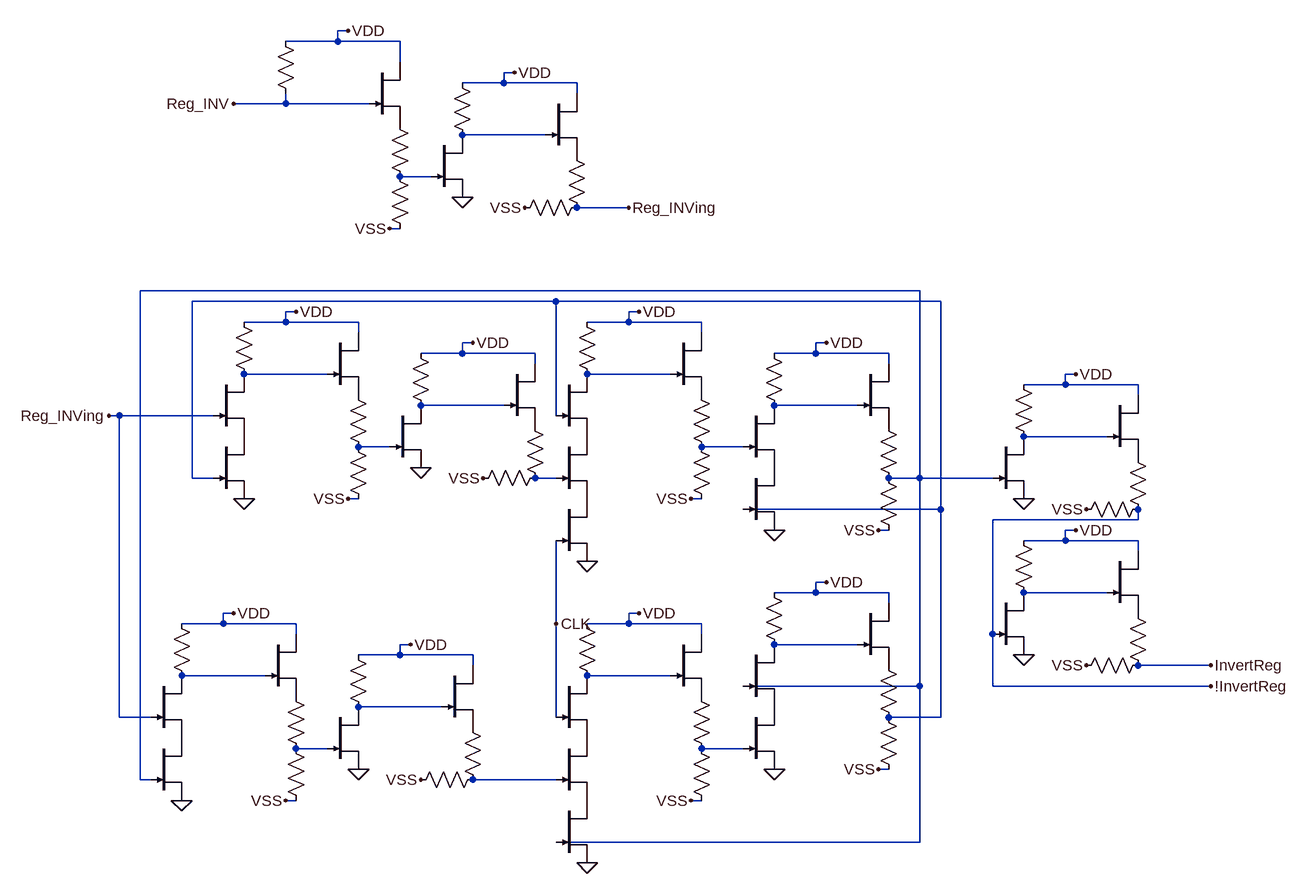
[diagram p0: schematic inverter_logic.asc]
inverter_logic.asc, the LTspice schematic file:
Version 4.1
SHEET 1 109444 42780
WIRE -992 -1136 -1008 -1136
WIRE -1008 -1120 -1008 -1136
WIRE -1008 -1120 -1088 -1120
WIRE -912 -1120 -1008 -1120
WIRE -912 -1088 -912 -1120
WIRE -736 -1072 -752 -1072
WIRE -752 -1056 -752 -1072
WIRE -752 -1056 -816 -1056
WIRE -640 -1056 -752 -1056
WIRE -640 -1040 -640 -1056
WIRE -1088 -1024 -1088 -1040
WIRE -1088 -1024 -1168 -1024
WIRE -960 -1024 -1088 -1024
WIRE -688 -976 -816 -976
WIRE -864 -912 -912 -912
WIRE -560 -864 -640 -864
WIRE -912 -832 -928 -832
WIRE -112 -736 -1312 -736
WIRE -672 -720 -1232 -720
WIRE -80 -720 -672 -720
WIRE -1072 -704 -1088 -704
WIRE -544 -704 -560 -704
WIRE -1088 -688 -1088 -704
WIRE -1088 -688 -1152 -688
WIRE -976 -688 -1088 -688
WIRE -560 -688 -560 -704
WIRE -560 -688 -624 -688
WIRE -448 -688 -560 -688
WIRE -976 -672 -976 -688
WIRE -448 -672 -448 -688
WIRE -800 -656 -816 -656
WIRE -256 -656 -272 -656
WIRE -816 -640 -816 -656
WIRE -816 -640 -880 -640
WIRE -704 -640 -816 -640
WIRE -272 -640 -272 -656
WIRE -272 -640 -336 -640
WIRE -160 -640 -272 -640
WIRE -704 -624 -704 -640
WIRE -160 -624 -160 -640
WIRE -1024 -608 -1152 -608
WIRE -496 -608 -624 -608
WIRE 128 -608 112 -608
WIRE 112 -592 112 -608
WIRE 112 -592 48 -592
WIRE 224 -592 112 -592
WIRE 224 -576 224 -592
WIRE -752 -560 -880 -560
WIRE -208 -560 -336 -560
WIRE -1344 -544 -1360 -544
WIRE -1200 -544 -1344 -544
WIRE -672 -544 -672 -720
WIRE 176 -512 48 -512
WIRE -928 -496 -976 -496
WIRE -384 -496 -448 -496
WIRE -1232 -448 -1232 -720
WIRE -1200 -448 -1232 -448
WIRE -672 -448 -704 -448
WIRE -112 -448 -112 -736
WIRE -112 -448 -160 -448
WIRE 0 -448 -112 -448
WIRE -976 -416 -992 -416
WIRE -448 -416 -464 -416
WIRE -80 -400 -80 -720
WIRE -80 -400 -384 -400
WIRE 224 -384 224 -400
WIRE 224 -384 0 -384
WIRE -160 -368 -176 -368
WIRE 128 -368 112 -368
WIRE 112 -352 112 -368
WIRE 112 -352 48 -352
WIRE 224 -352 112 -352
WIRE 224 -336 224 -352
WIRE -256 -288 -272 -288
WIRE -272 -272 -272 -288
WIRE -272 -272 -336 -272
WIRE -160 -272 -272 -272
WIRE 176 -272 48 -272
WIRE -160 -256 -160 -272
WIRE -1168 -240 -1184 -240
WIRE -544 -240 -560 -240
WIRE -1184 -224 -1184 -240
WIRE -1184 -224 -1248 -224
WIRE -1072 -224 -1184 -224
WIRE -672 -224 -672 -352
WIRE -560 -224 -560 -240
WIRE -560 -224 -624 -224
WIRE -448 -224 -560 -224
WIRE -1072 -208 -1072 -224
WIRE -448 -208 -448 -224
WIRE 0 -208 0 -384
WIRE -896 -192 -912 -192
WIRE -208 -192 -336 -192
WIRE -912 -176 -912 -192
WIRE -912 -176 -976 -176
WIRE -800 -176 -912 -176
WIRE -800 -160 -800 -176
WIRE 336 -160 224 -160
WIRE -1120 -144 -1248 -144
WIRE -496 -144 -624 -144
WIRE -112 -128 -112 -448
WIRE -112 -128 -384 -128
WIRE 0 -128 0 -208
WIRE 336 -128 0 -128
WIRE -848 -96 -976 -96
WIRE -1344 -80 -1344 -544
WIRE -1296 -80 -1344 -80
WIRE -672 -80 -672 -224
WIRE -80 -80 -80 -400
WIRE -80 -80 -160 -80
WIRE -1024 -32 -1072 -32
WIRE -384 -32 -448 -32
WIRE -160 0 -176 0
WIRE -1312 16 -1312 -736
WIRE -1296 16 -1312 16
WIRE -672 16 -800 16
WIRE -1072 48 -1088 48
WIRE -448 48 -464 48
WIRE -112 112 -112 -128
WIRE -112 112 -672 112
FLAG -1168 -1024 Reg_INV
FLAG -816 -880 0
FLAG -992 -1136 VDD
FLAG -736 -1072 VDD
FLAG -928 -832 VSS
FLAG -720 -864 VSS
FLAG -1152 -416 0
FLAG -880 -464 0
FLAG -1072 -704 VDD
FLAG -800 -656 VDD
FLAG -992 -416 VSS
FLAG -784 -448 VSS
FLAG -1248 48 0
FLAG -976 0 0
FLAG -1168 -240 VDD
FLAG -896 -192 VDD
FLAG -1088 48 VSS
FLAG -880 16 VSS
FLAG -624 -320 0
FLAG -544 -704 VDD
FLAG -464 -416 VSS
FLAG -624 144 0
FLAG -544 -240 VDD
FLAG -464 48 VSS
FLAG -336 -368 0
FLAG -256 -656 VDD
FLAG -176 -368 VSS
FLAG -336 0 0
FLAG -256 -288 VDD
FLAG -176 0 VSS
FLAG -672 -224 CLK
FLAG -560 -864 Reg_INVing
FLAG -1360 -544 Reg_INVing
FLAG 48 -416 0
FLAG 128 -608 VDD
FLAG 144 -400 VSS
FLAG 48 -176 0
FLAG 128 -368 VDD
FLAG 144 -160 VSS
FLAG 336 -160 InvertReg
FLAG 336 -128 !InvertReg
SYMBOL res -1104 -1136 R0
WINDOW 0 -35 57 Invisible 2
WINDOW 3 34 56 Invisible 2
SYMATTR InstName R3757
SYMATTR Value 100k
SYMBOL njf -960 -1088 R0
WINDOW 0 56 32 Invisible 2
WINDOW 3 56 72 Invisible 2
SYMATTR InstName J_F944
SYMATTR Value DR
SYMBOL res -928 -1008 R0
WINDOW 0 -24 60 Invisible 2
WINDOW 3 34 58 Invisible 2
SYMATTR InstName R3758
SYMATTR Value 1k
SYMBOL res -928 -928 R0
WINDOW 0 -22 62 Invisible 2
WINDOW 3 37 62 Invisible 2
SYMATTR InstName R3759
SYMATTR Value 4.8k
SYMBOL njf -864 -976 R0
WINDOW 0 56 32 Invisible 2
WINDOW 3 56 72 Invisible 2
SYMATTR InstName J_A2331
SYMATTR Value DR
SYMBOL res -832 -1072 R0
WINDOW 0 56 32 Invisible 2
WINDOW 3 56 72 Invisible 2
SYMATTR InstName R3760
SYMATTR Value 50k
SYMBOL njf -688 -1040 R0
WINDOW 0 56 32 Invisible 2
WINDOW 3 56 72 Invisible 2
SYMATTR InstName J_A2332
SYMATTR Value DR
SYMBOL res -656 -960 R0
WINDOW 0 37 24 Invisible 2
WINDOW 3 -30 25 Invisible 2
SYMATTR InstName R3761
SYMATTR Value 1k
SYMBOL res -624 -880 R90
WINDOW 0 59 66 Invisible 2
WINDOW 3 34 13 Invisible 2
SYMATTR InstName R3762
SYMATTR Value 4.5k
SYMBOL njf -1200 -608 R0
WINDOW 0 56 32 Invisible 2
WINDOW 3 56 72 Invisible 2
SYMATTR InstName J_A2349
SYMATTR Value DR
SYMBOL res -1168 -704 R0
WINDOW 0 56 32 Invisible 2
WINDOW 3 56 72 Invisible 2
SYMATTR InstName R3787
SYMATTR Value 100k
SYMBOL njf -1024 -672 R0
WINDOW 0 56 32 Invisible 2
WINDOW 3 56 72 Invisible 2
SYMATTR InstName J_F949
SYMATTR Value DR
SYMBOL res -992 -592 R0
WINDOW 0 38 53 Invisible 2
WINDOW 3 -35 51 Invisible 2
SYMATTR InstName R3788
SYMATTR Value 1k
SYMBOL res -992 -512 R0
WINDOW 0 41 61 Invisible 2
WINDOW 3 -53 52 Invisible 2
SYMATTR InstName R3789
SYMATTR Value 4.8k
SYMBOL njf -1200 -512 R0
WINDOW 0 56 32 Invisible 2
WINDOW 3 56 72 Invisible 2
SYMATTR InstName J_B1101
SYMATTR Value DR
SYMBOL njf -928 -560 R0
WINDOW 0 56 32 Invisible 2
WINDOW 3 56 72 Invisible 2
SYMATTR InstName J_A2350
SYMATTR Value DR
SYMBOL res -896 -656 R0
WINDOW 0 56 32 Invisible 2
WINDOW 3 56 72 Invisible 2
SYMATTR InstName R3790
SYMATTR Value 50k
SYMBOL njf -752 -624 R0
WINDOW 0 56 32 Invisible 2
WINDOW 3 56 72 Invisible 2
SYMATTR InstName J_F950
SYMATTR Value DR
SYMBOL res -720 -544 R0
WINDOW 0 37 24 Invisible 2
WINDOW 3 -30 25 Invisible 2
SYMATTR InstName R3791
SYMATTR Value 1k
SYMBOL res -688 -464 R90
WINDOW 0 59 66 Invisible 2
WINDOW 3 34 13 Invisible 2
SYMATTR InstName R3792
SYMATTR Value 4.5k
SYMBOL njf -1296 -144 R0
WINDOW 0 56 32 Invisible 2
WINDOW 3 56 72 Invisible 2
SYMATTR InstName J_A2351
SYMATTR Value DR
SYMBOL res -1264 -240 R0
WINDOW 0 56 32 Invisible 2
WINDOW 3 56 72 Invisible 2
SYMATTR InstName R3793
SYMATTR Value 100k
SYMBOL njf -1120 -208 R0
WINDOW 0 56 32 Invisible 2
WINDOW 3 56 72 Invisible 2
SYMATTR InstName J_F951
SYMATTR Value DR
SYMBOL res -1088 -128 R0
WINDOW 0 38 53 Invisible 2
WINDOW 3 -35 51 Invisible 2
SYMATTR InstName R3794
SYMATTR Value 1k
SYMBOL res -1088 -48 R0
WINDOW 0 41 61 Invisible 2
WINDOW 3 -53 52 Invisible 2
SYMATTR InstName R3795
SYMATTR Value 4.8k
SYMBOL njf -1296 -48 R0
WINDOW 0 56 32 Invisible 2
WINDOW 3 56 72 Invisible 2
SYMATTR InstName J_B1102
SYMATTR Value DR
SYMBOL njf -1024 -96 R0
WINDOW 0 56 32 Invisible 2
WINDOW 3 56 72 Invisible 2
SYMATTR InstName J_A2352
SYMATTR Value DR
SYMBOL res -992 -192 R0
WINDOW 0 56 32 Invisible 2
WINDOW 3 56 72 Invisible 2
SYMATTR InstName R3796
SYMATTR Value 50k
SYMBOL njf -848 -160 R0
WINDOW 0 56 32 Invisible 2
WINDOW 3 56 72 Invisible 2
SYMATTR InstName J_F952
SYMATTR Value DR
SYMBOL res -816 -80 R0
WINDOW 0 37 24 Invisible 2
WINDOW 3 -30 25 Invisible 2
SYMATTR InstName R3797
SYMATTR Value 1k
SYMBOL res -784 0 R90
WINDOW 0 59 66 Invisible 2
WINDOW 3 34 13 Invisible 2
SYMATTR InstName R3798
SYMATTR Value 4.5k
SYMBOL njf -672 -608 R0
WINDOW 0 56 32 Invisible 2
WINDOW 3 56 72 Invisible 2
SYMATTR InstName J_A2353
SYMATTR Value DR
SYMBOL res -640 -704 R0
WINDOW 0 56 32 Invisible 2
WINDOW 3 56 72 Invisible 2
SYMATTR InstName R3799
SYMATTR Value 100k
SYMBOL njf -496 -672 R0
WINDOW 0 56 32 Invisible 2
WINDOW 3 56 72 Invisible 2
SYMATTR InstName J_F953
SYMATTR Value DR
SYMBOL res -464 -592 R0
WINDOW 0 38 53 Invisible 2
WINDOW 3 -35 51 Invisible 2
SYMATTR InstName R3800
SYMATTR Value 1k
SYMBOL res -464 -512 R0
WINDOW 0 41 61 Invisible 2
WINDOW 3 -53 52 Invisible 2
SYMATTR InstName R3801
SYMATTR Value 4.8k
SYMBOL njf -672 -512 R0
WINDOW 0 56 32 Invisible 2
WINDOW 3 56 72 Invisible 2
SYMATTR InstName J_B1103
SYMATTR Value DR
SYMBOL njf -672 -144 R0
WINDOW 0 56 32 Invisible 2
WINDOW 3 56 72 Invisible 2
SYMATTR InstName J_A2354
SYMATTR Value DR
SYMBOL res -640 -240 R0
WINDOW 0 56 32 Invisible 2
WINDOW 3 56 72 Invisible 2
SYMATTR InstName R3802
SYMATTR Value 100k
SYMBOL njf -496 -208 R0
WINDOW 0 56 32 Invisible 2
WINDOW 3 56 72 Invisible 2
SYMATTR InstName J_F954
SYMATTR Value DR
SYMBOL res -464 -128 R0
WINDOW 0 38 53 Invisible 2
WINDOW 3 -35 51 Invisible 2
SYMATTR InstName R3803
SYMATTR Value 1k
SYMBOL res -464 -48 R0
WINDOW 0 41 61 Invisible 2
WINDOW 3 -53 52 Invisible 2
SYMATTR InstName R3804
SYMATTR Value 4.8k
SYMBOL njf -672 -48 R0
WINDOW 0 56 32 Invisible 2
WINDOW 3 56 72 Invisible 2
SYMATTR InstName J_B1104
SYMATTR Value DR
SYMBOL njf -384 -560 R0
WINDOW 0 56 32 Invisible 2
WINDOW 3 56 72 Invisible 2
SYMATTR InstName J_A2355
SYMATTR Value DR
SYMBOL res -352 -656 R0
WINDOW 0 56 32 Invisible 2
WINDOW 3 56 72 Invisible 2
SYMATTR InstName R3805
SYMATTR Value 100k
SYMBOL njf -208 -624 R0
WINDOW 0 56 32 Invisible 2
WINDOW 3 56 72 Invisible 2
SYMATTR InstName J_F955
SYMATTR Value DR
SYMBOL res -176 -544 R0
WINDOW 0 38 53 Invisible 2
WINDOW 3 -35 51 Invisible 2
SYMATTR InstName R3806
SYMATTR Value 1k
SYMBOL res -176 -464 R0
WINDOW 0 -62 31 Invisible 2
WINDOW 3 -53 52 Invisible 2
SYMATTR InstName R3807
SYMATTR Value 4.8k
SYMBOL njf -384 -464 R0
WINDOW 0 56 32 Invisible 2
WINDOW 3 56 72 Invisible 2
SYMATTR InstName J_B1105
SYMATTR Value DR
SYMBOL njf -384 -192 R0
WINDOW 0 56 32 Invisible 2
WINDOW 3 56 72 Invisible 2
SYMATTR InstName J_A2356
SYMATTR Value DR
SYMBOL res -352 -288 R0
WINDOW 0 56 32 Invisible 2
WINDOW 3 56 72 Invisible 2
SYMATTR InstName R3808
SYMATTR Value 100k
SYMBOL njf -208 -256 R0
WINDOW 0 56 32 Invisible 2
WINDOW 3 56 72 Invisible 2
SYMATTR InstName J_F956
SYMATTR Value DR
SYMBOL res -176 -176 R0
WINDOW 0 38 53 Invisible 2
WINDOW 3 -35 51 Invisible 2
SYMATTR InstName R3809
SYMATTR Value 1k
SYMBOL res -176 -96 R0
WINDOW 0 41 61 Invisible 2
WINDOW 3 -53 52 Invisible 2
SYMATTR InstName R3810
SYMATTR Value 4.8k
SYMBOL njf -384 -96 R0
WINDOW 0 56 32 Invisible 2
WINDOW 3 56 72 Invisible 2
SYMATTR InstName J_B1106
SYMATTR Value DR
SYMBOL njf -672 -416 R0
WINDOW 0 56 32 Invisible 2
WINDOW 3 56 72 Invisible 2
SYMATTR InstName J_B1107
SYMATTR Value DR
SYMBOL njf -672 48 R0
WINDOW 0 56 32 Invisible 2
WINDOW 3 56 72 Invisible 2
SYMATTR InstName J_B1108
SYMATTR Value DR
SYMBOL njf 0 -512 R0
WINDOW 0 56 32 Invisible 2
WINDOW 3 56 72 Invisible 2
SYMATTR InstName J_A2357
SYMATTR Value DR
SYMBOL res 32 -608 R0
WINDOW 0 56 32 Invisible 2
WINDOW 3 56 72 Invisible 2
SYMATTR InstName R3811
SYMATTR Value 50k
SYMBOL njf 176 -576 R0
WINDOW 0 56 32 Invisible 2
WINDOW 3 56 72 Invisible 2
SYMATTR InstName J_F957
SYMATTR Value DR
SYMBOL res 208 -496 R0
WINDOW 0 37 24 Invisible 2
WINDOW 3 -30 25 Invisible 2
SYMATTR InstName R3812
SYMATTR Value 1k
SYMBOL res 240 -416 R90
WINDOW 0 59 66 Invisible 2
WINDOW 3 34 13 Invisible 2
SYMATTR InstName R3813
SYMATTR Value 4.5k
SYMBOL njf 0 -272 R0
WINDOW 0 56 32 Invisible 2
WINDOW 3 56 72 Invisible 2
SYMATTR InstName J_A2358
SYMATTR Value DR
SYMBOL res 32 -368 R0
WINDOW 0 56 32 Invisible 2
WINDOW 3 56 72 Invisible 2
SYMATTR InstName R3814
SYMATTR Value 50k
SYMBOL njf 176 -336 R0
WINDOW 0 56 32 Invisible 2
WINDOW 3 56 72 Invisible 2
SYMATTR InstName J_F958
SYMATTR Value DR
SYMBOL res 208 -256 R0
WINDOW 0 37 24 Invisible 2
WINDOW 3 -30 25 Invisible 2
SYMATTR InstName R3815
SYMATTR Value 1k
SYMBOL res 240 -176 R90
WINDOW 0 59 66 Invisible 2
WINDOW 3 34 13 Invisible 2
SYMATTR InstName R3816
SYMATTR Value 4.5k

The netlist it stands for:
* inverter_logic.asc
R3757 VDD Reg_INV 100k
J_F944 VDD Reg_INV P001 DR
R3758 P001 N002 1k
R3759 N002 VSS 4.8k
J_A2331 N001 N002 0 DR
R3760 VDD N001 50k
J_A2332 VDD N001 P002 DR
R3761 P002 Reg_INVing 1k
R3762 Reg_INVing VSS 4.5k
J_A2349 N005 Reg_INVing P003 DR
R3787 VDD N005 100k
J_F949 VDD N005 P004 DR
R3788 P004 N010 1k
R3789 N010 VSS 4.8k
J_B1101 P003 N004 0 DR
J_A2350 N007 N010 0 DR
R3790 VDD N007 50k
J_F950 VDD N007 P005 DR
R3791 P005 N012 1k
R3792 N012 VSS 4.5k
J_A2351 N015 Reg_INVing P006 DR
R3793 VDD N015 100k
J_F951 VDD N015 P007 DR
R3794 P007 N018 1k
R3795 N018 VSS 4.8k
J_B1102 P006 N003 0 DR
J_A2352 N017 N018 0 DR
R3796 VDD N017 50k
J_F952 VDD N017 P008 DR
R3797 P008 N020 1k
R3798 N020 VSS 4.5k
J_A2353 N006 N004 P009 DR
R3799 VDD N006 100k
J_F953 VDD N006 P010 DR
R3800 P010 N011 1k
R3801 N011 VSS 4.8k
J_B1103 P009 N012 P011 DR
J_A2354 N016 CLK P012 DR
R3802 VDD N016 100k
J_F954 VDD N016 P013 DR
R3803 P013 N019 1k
R3804 N019 VSS 4.8k
J_B1104 P012 N020 P014 DR
J_A2355 N008 N011 P015 DR
R3805 VDD N008 100k
J_F955 VDD N008 P016 DR
R3806 P016 N003 1k
R3807 N003 VSS 4.8k
J_B1105 P015 N004 0 DR
J_A2356 N014 N003 P017 DR
R3808 VDD N014 100k
J_F956 VDD N014 P018 DR
R3809 P018 N004 1k
R3810 N004 VSS 4.8k
J_B1106 P017 N019 0 DR
J_B1107 P011 CLK 0 DR
J_B1108 P014 N003 0 DR
J_A2357 N009 N003 0 DR
R3811 VDD N009 50k
J_F957 VDD N009 P019 DR
R3812 P019 !InvertReg 1k
R3813 !InvertReg VSS 4.5k
J_A2358 N013 !InvertReg 0 DR
R3814 VDD N013 50k
J_F958 VDD N013 P020 DR
R3815 P020 InvertReg 1k
R3816 InvertReg VSS 4.5k
.model NJF NJF
.model PJF PJF
.lib standard.jft
.backanno
.end